# Altium schematic sheet MPU.SchDoc
size A4; SheetNumber: 6; SheetTotal: 8
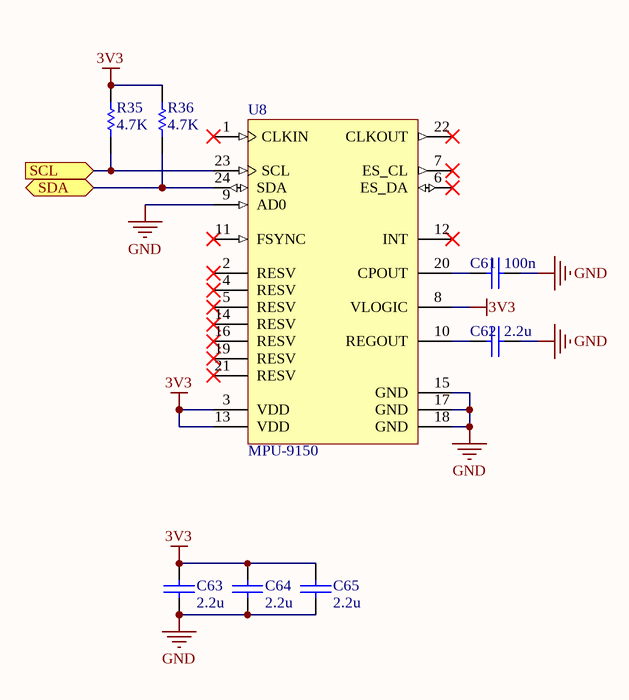
[diagram p0: MPU.SchDoc]

## Parts
C61  100n  [0603C]
C62  2.2u  [0603C]
C63  2.2u  [0603C]
C64  2.2u  [0603C]
C65  2.2u  [0603C]
R35  4.7K  [0603R]
R36  4.7K  [0603R]
U8  MPU-9150  [IS-QFN-24_4000X4000X1100_V]

## Ports
SCL (in), SDA (bidir)

## Nets
3V3: C63.2 C64.2 C65.2 R35.2 R36.2 U8.3(VDD) U8.8(VLOGIC) U8.13(VDD)
GND: C61.2 C62.2 C63.1 C64.1 C65.1 U8.9(AD0) U8.15(GND) U8.17(GND) U8.18(GND)
SCL: R35.1 U8.23(SCL) ; port SCL
SDA: R36.1 U8.24(SDA) ; port SDA
NetC61_1: C61.1 U8.20(CPOUT)
NetC62_1: C62.1 U8.10(REGOUT)

Not connected (* = marked no-connect by the designer): U8 1(CLKIN)* 2(RESV)* 4(RESV)* 5(RESV)* 6(ES_DA)* 7(ES_CL)* 11(FSYNC)* 12(INT)* 14(RESV)* 16(RESV)* 19(RESV)* 21(RESV)* 22(CLKOUT)*

## Library data of the parts
C61-C65 = CAP: 无极性电容
R35 R36 = RES
U8 = CMP-2000-05158-1: 9-Axis MotionTracking Device, 2.375 to 3.465 V, -40 to 85 degC, 24-Pin QFN, RoHS, Tape and Reel; Manufacturer: InvenSense; Featured Product: MPU-9150Nine-Axis(Gyro+Accelerometer+Compass)MEMSMotionTracking™Device; Output Type: I²C; PCN Obsolescence/ EOL: MPU-9150Devices25/Mar/2015; Sensor Type: Accelerometer,Gyroscope,Magnetometer,3Axis; Other Names: 1428-1009-2 / MPU9150; For Use With: 1471-1460-ND / -MPU9DOFCLICK / 1568-1017-ND / -MPU-9150GYROACCELIMU9DOF / 1428-1010-ND / -BOARDEVALFORMPU-9150; Manufacturer URL: http://www.invensense.com/; Category: Sensors,Transducers; Operating Temperature: -40degC~85degC(TA); Datasheet URL: http://datasheet.octopart.com/MPU-9150-InvenSense-datasheet-11519227.pdf; Series: MotionTracking™; Datasheet Version: Rev. 4.0, 05/2012; Family: Multifunction; Standard Package: 5,000